# EAGLE design Programmer (EAGLE 6.1)
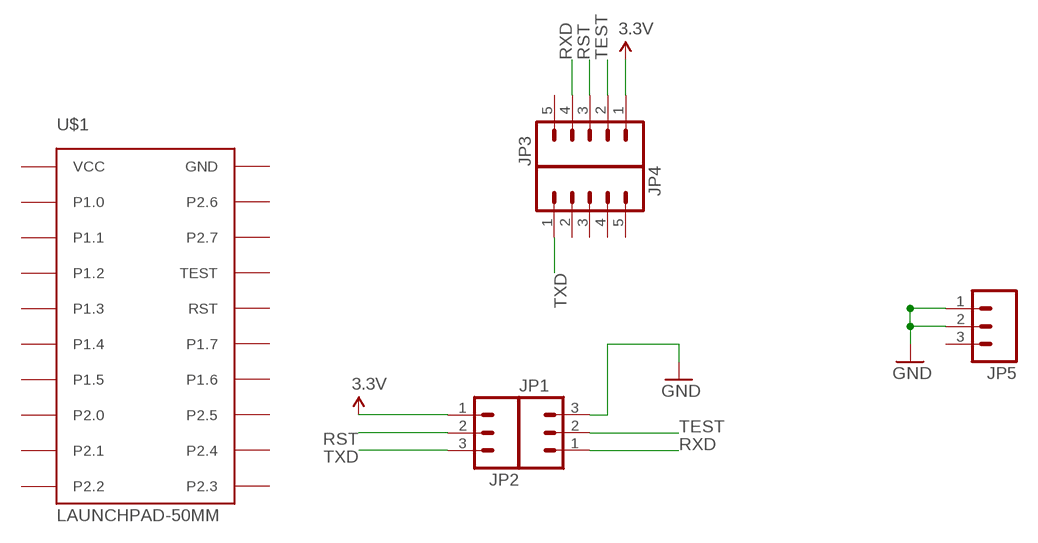
[diagram p0: schematic, sheet 1]

## Parts
JP1  M03LOCK  [1X03_LOCK]
JP2  M03LOCK  [1X03_LOCK]
JP3  M05LOCK  [1X05_LOCK]
JP4  M05LOCK  [1X05_LOCK]
JP5  M03LOCK  [1X03_LOCK]
U$1  LAUNCHPAD-50MM  [LAUNCHPAD-50MM]

## Nets
3.3V: JP2.1 JP3.1
GND: JP1.3 JP5.1 JP5.2
RST: JP2.2 JP3.3
RXD: JP1.1 JP3.4
TEST: JP1.2 JP3.2
TXD: JP2.3 JP4.1
Unconnected: JP3.5 JP4.2 JP4.3 JP4.4 JP4.5 JP5.3 U$1.P1.0 U$1.P1.1 U$1.P1.2 U$1.P1.3 U$1.P1.4 U$1.P1.5 U$1.P1.6 U$1.P1.7 U$1.P2.0 U$1.P2.1 U$1.P2.2 U$1.P2.3 U$1.P2.4 U$1.P2.5 U$1.P2.6 U$1.P2.7 U$1.RST U$1.TEST

## Power pins joined to a net without a drawn wire
GND: U$1.GND
VCC: U$1.VCC

## Library data of the parts
JP1 JP2 JP5 = SparkFun:M03: Header 3 Standard 3-pin 0.1" header. Use with straight break away headers (SKU : PRT-00116), right angle break away headers (PRT-00553), swiss pins (PRT-00743), machine pins (PRT-00117), and female headers (PRT-00115). Molex polarized connector foot print use with SKU : PRT-08232 with associated crimp pins and housings.
JP3 JP4 = SparkFun:M05: Header 5 Standard 5-pin 0.1" header. Use with straight break away headers (SKU : PRT-00116), right angle break away headers (PRT-00553), swiss pins (PRT-00743), machine pins (PRT-00117), and female headers (PRT-00115). Molex polarized connector foot print use with SKU : PRT-08230 with associated crimp pins and housings.
U$1 = TI_launchpad:LAUNCHPAD: MSP-EXP430G2 LaunchPad Booster Pack layouts. LAUNCHPAD: Full-size board LAUNCHPAD-50MM: 50x50mm board covering the button area LAUNCHPAD-50MM-LEFT: 50x50mm board leaving the button area open. Tall LaunchPad components marked on Reference for reference.

## Board
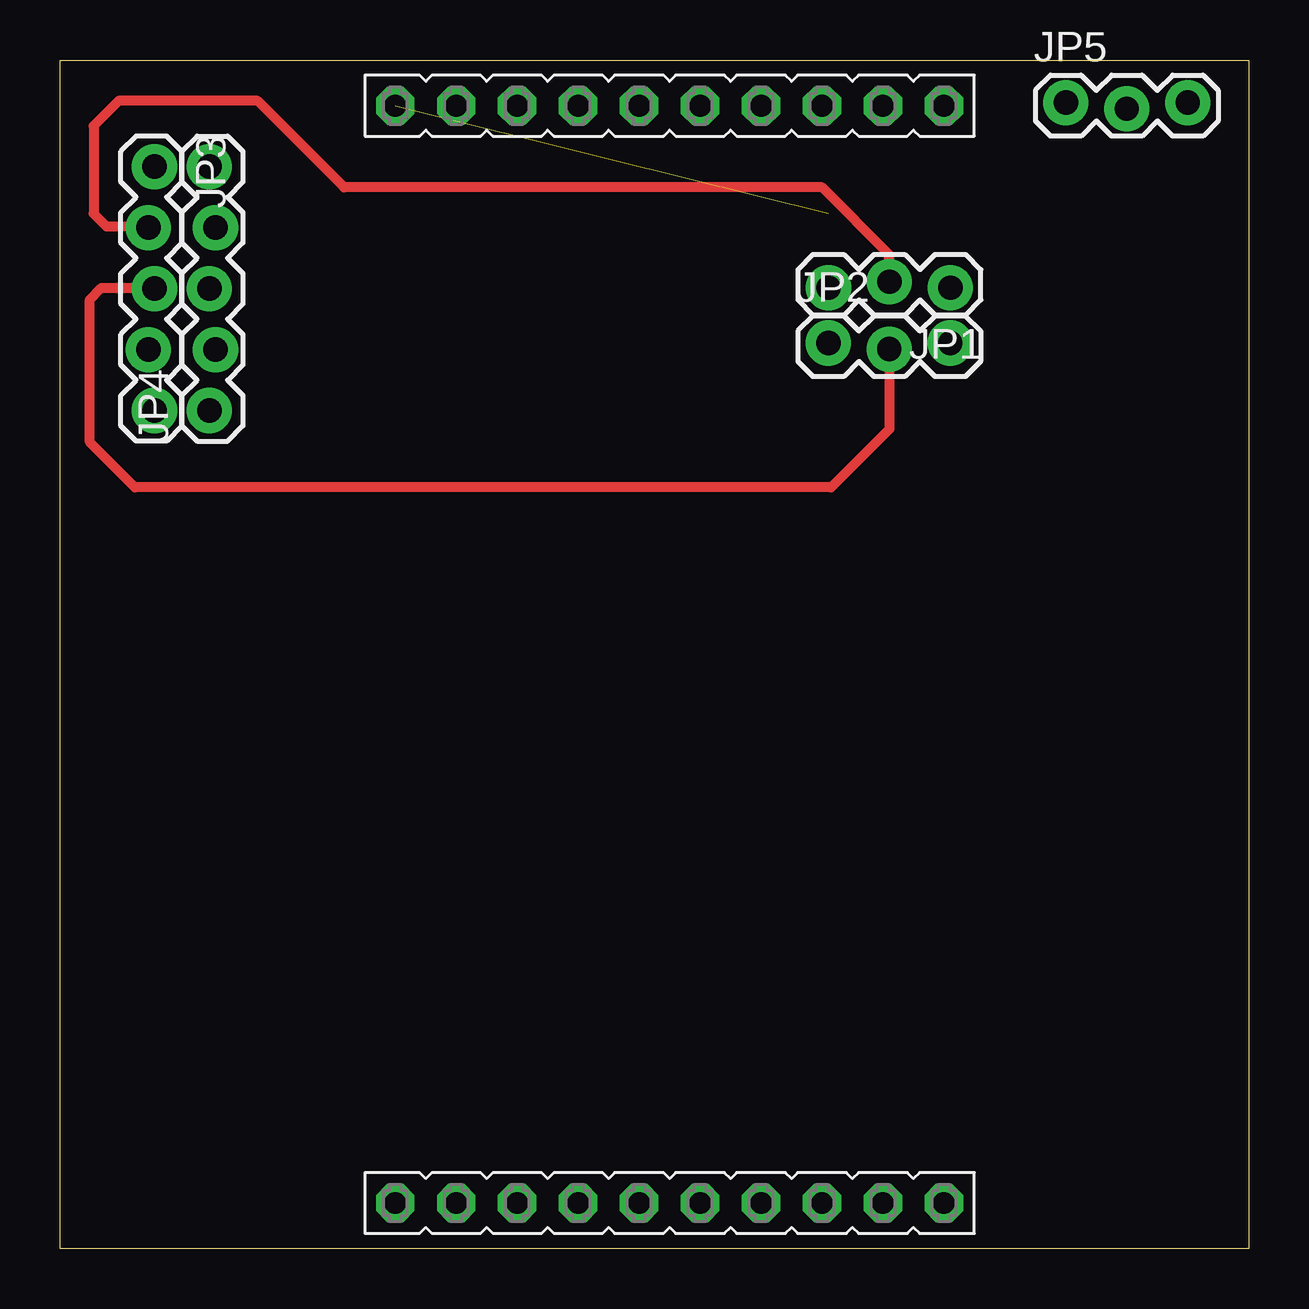
[diagram p1: board, top side]
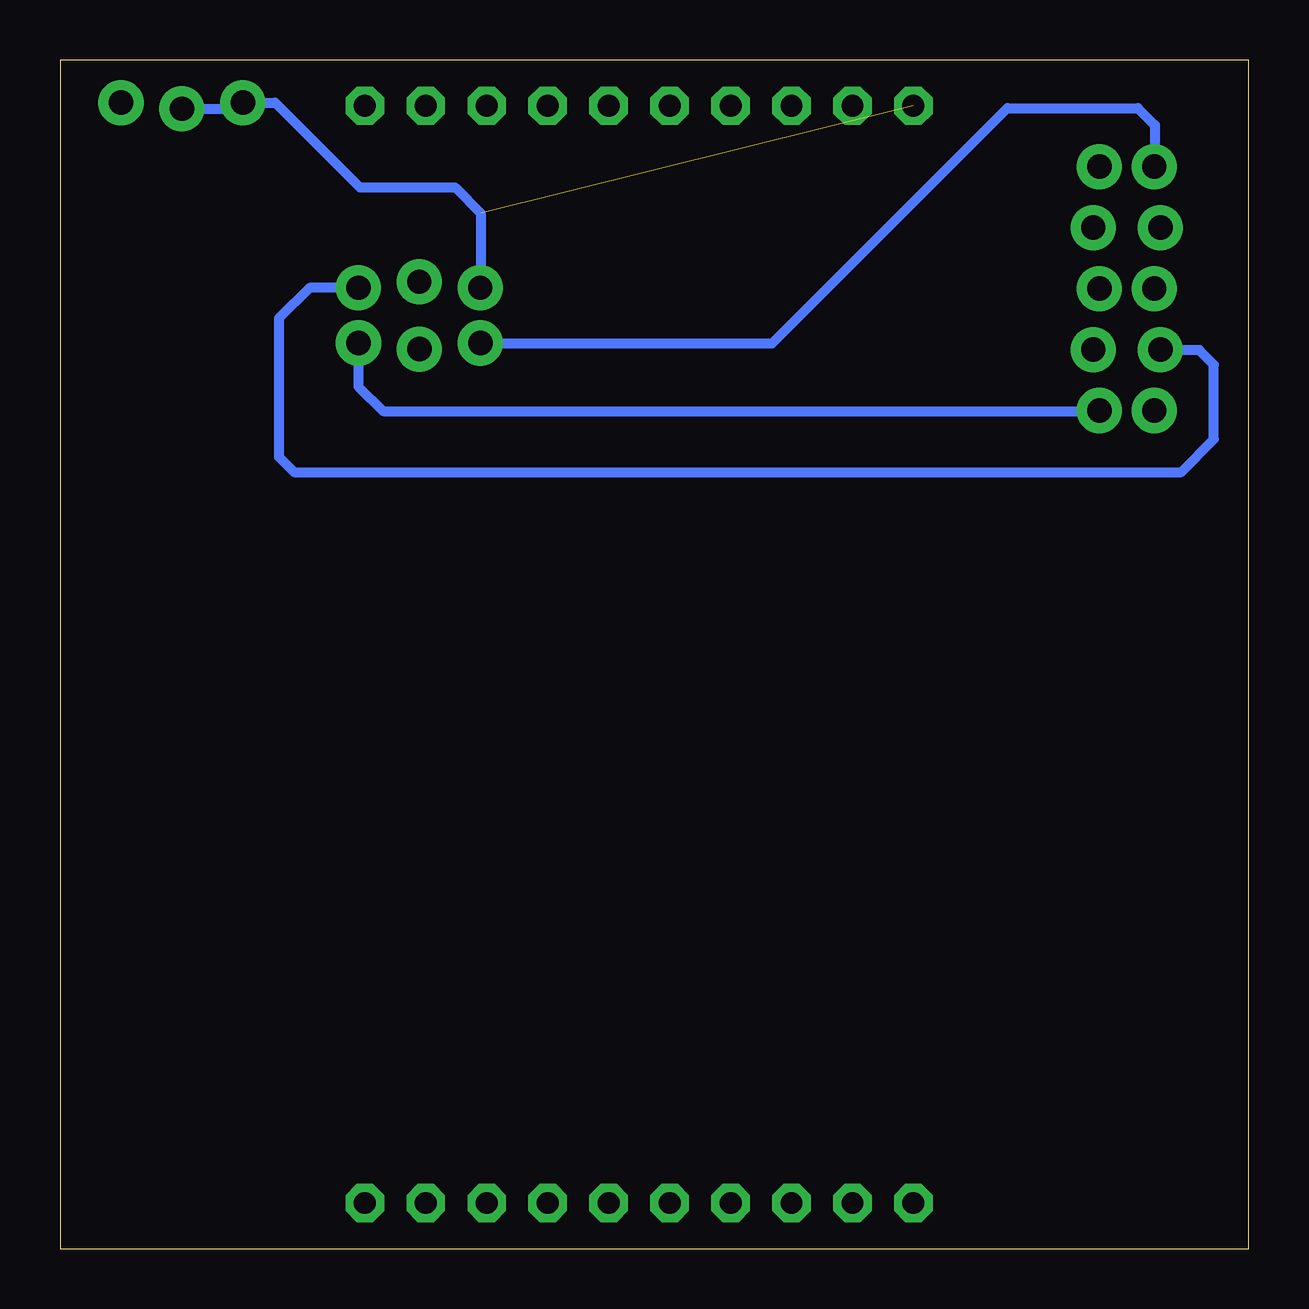
[diagram p2: board, bottom side, seen from below]

Size 49.53 x 49.53 mm. Coordinates in mm from the lower left corner, seen from the top.
Copper layers (1*16): Top 0.0178mm / dielectric 59mil / Bottom 0.0178mm
Design rules "default": minimum track width 6mil, minimum drill 14mil, track to track 6mil, track to pad 6mil, pad to pad 6mil, via to via 6mil, smd to smd 6mil, copper to edge 20mil, drill to drill 16mil, minimum pad ring 8mil, minimum via ring 8mil, stop-mask expansion 3mil, vias tented up to drill 0mil, thermal gap 10mil

### Footprints (pad centres in the part's own frame; a part is rotated, then mirrored left to right if it is on the bottom)
1X03_LOCK = drill 1.016 pad 1.88: 1 0,0.127; 2 2.54,-0.127; 3 5.08,0.127
1X05_LOCK = drill 1.016 pad 1.88: 1 0,0.127; 2 2.54,-0.127; 3 5.08,0.127; 4 7.62,-0.127; 5 10.16,0.127
LAUNCHPAD-50MM = drill 0.914 pad 1.6 octagon: GND 13.97,48.26; P1.0 16.51,2.54; P1.1 19.05,2.54; P1.2 21.59,2.54; P1.3 24.13,2.54; P1.4 26.67,2.54; P1.5 29.21,2.54; P1.6 29.21,48.26; P1.7 26.67,48.26; P2.0 31.75,2.54; P2.1 34.29,2.54; P2.2 36.83,2.54; P2.3 36.83,48.26; P2.4 34.29,48.26; P2.5 31.75,48.26; P2.6 16.51,48.26; P2.7 19.05,48.26; RST 24.13,48.26; TEST 21.59,48.26; VCC 13.97,2.54

### Placement (x,y rotation side)
JP1  37.1,40.17 180 top
JP2  32.01,37.61 0 top
JP3  3.81,45.09 270 top
JP4  6.35,34.92 90 top
JP5  41.91,47.62 0 top
U$1  0,-0.64 0 top

### Tracks (layer width: path | path; a pad name or v marks a point on that pad's centre or on a via)
3.3V
  Bottom 0.406: JP2.1 32,37.73 19.86,37.73 10.06,47.52 4.62,47.52 3.91,46.81 3.91,45.11 JP3.1
GND  (1 unrouted)
  Bottom 0.406: JP1.3 32,40.05 32,43.16 33.07,44.22 37.03,44.22 40.56,47.75 41.83,47.75 | JP5.2 42.09,47.5 41.83,47.75 | 41.83,47.75 JP5.1
RST
  Top 0.406: JP2.2 34.55,34.15 32.13,31.73 3.12,31.73 1.25,33.6 1.25,39.55 1.73,40.03 3.91,40.03 JP3.3
RXD
  Bottom 0.406: JP1.1 39.13,40.04 40.41,38.76 40.41,32.99 39.78,32.36 2.82,32.36 1.45,33.73 1.45,36.83 2.06,37.44 3.66,37.44 JP3.4
TEST
  Top 0.406: JP1.2 34.56,41.41 31.75,44.22 11.84,44.22 8.23,47.83 2.44,47.83 1.4,46.79 1.4,43.13 1.93,42.6 3.63,42.6 JP3.2
TXD
  Bottom 0.406: JP2.3 37.09,35.92 36.07,34.9 6.25,34.9 JP4.1

### Text on the board
210bmp: /Users/zacman/Documents/Graphics/KickSat/kicksatlogo4-silkscreen.bmp